# Altium schematic sheet Parallel PCU Test.SchDoc
size A; SheetNumber: 15; SheetTotal: 19
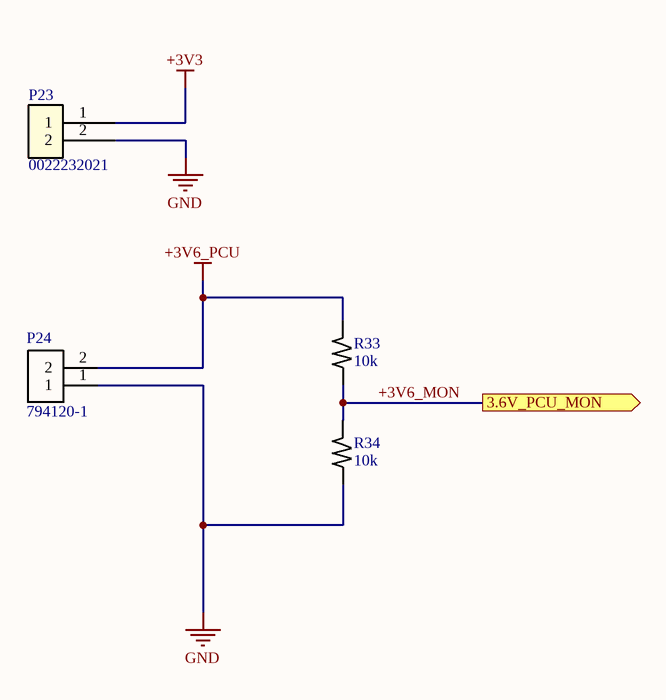
[diagram p0: Parallel PCU Test.SchDoc]

## Parts
P23  0022232021  [Signal2]
P24  794120-1  [POWER2-5.08 right angle]
R33  10k  [R0603]
R34  10k  [R0603]

## Ports
3.6V_PCU_MON (out)

## Nets
+3V3: P23.1
+3V6_PCU: P24.2 R33.2
GND: P23.2 P24.1 R34.1
+3V6_MON: R33.1 R34.2 ; port 3.6V_PCU_MON

## Notes on the sheet
- Project:
- Sheet Title:
- Size
- Date:
- A
- Sheet Number:
- Sheet Total:
- Revision:
- Time:
- Author:

## Library data of the parts
P23 = Signal2: SignalConnector, 2 leads; MF: Molex; ComponentLink1Description: Datasheet; ComponentLink1URL: https://www.molex.com/content/dam/molex/molex-dot-com/products/automated/en-us/salesdrawingpdf/637/6373/022232021_sd.pdf?inline; ComponentLink2Description: Supplier1; ComponentLink2URL: https://www.digikey.com/en/products/detail/molex/0022232021/26667; MP: 0022232021
P24 = Power2: PCB Mount Header, Right Angle, Wire-to-Board, 2 Position, 5.08 mm [.2 in] Centerline, Fully Shrouded, Pre-Tin, Commercial MATE-N-LOK; MP: TE Connectivity; MF: 794120-1; ComponentLink1Description: Datasheet; ComponentLink1URL: https://www.te.com/commerce/DocumentDelivery/DDEController?Action=srchrtrv&DocNm=114-1012&DocType=Specification%20Or%20Standard&DocLang=English&DocFormat=pdf&PartCntxt=794120-1; ComponentLink2Description: Supplier1
R33 R34 = Res: RES 10kΩ ±1% 100mW 0603; MF: FOJAN; MP: FRC0603F1002TS; ComponentLink1Description: Datasheet; ComponentLink1URL: https://www.lcsc.com/datasheet/C2906982.pdf; ComponentLink2Description: Supplier1; ComponentLink2URL: https://www.lcsc.com/product-detail/C2906982.html